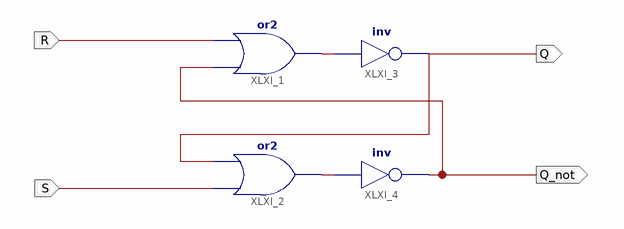
[diagram p0: schematic sheet 1]
// Xilinx ISE schematic SR_Latch.sch (spartan6) as structural Verilog: 4 symbols, 4 ports
module SR_Latch (
  input  R,
  input  S,
  output Q,
  output Q_not
);

  wire XLXN_1, XLXN_2;

  or XLXI_1 (XLXN_1, Q_not, R);
  or XLXI_2 (XLXN_2, S, Q);
  not XLXI_3 (Q, XLXN_1);
  not XLXI_4 (Q_not, XLXN_2);
endmodule
